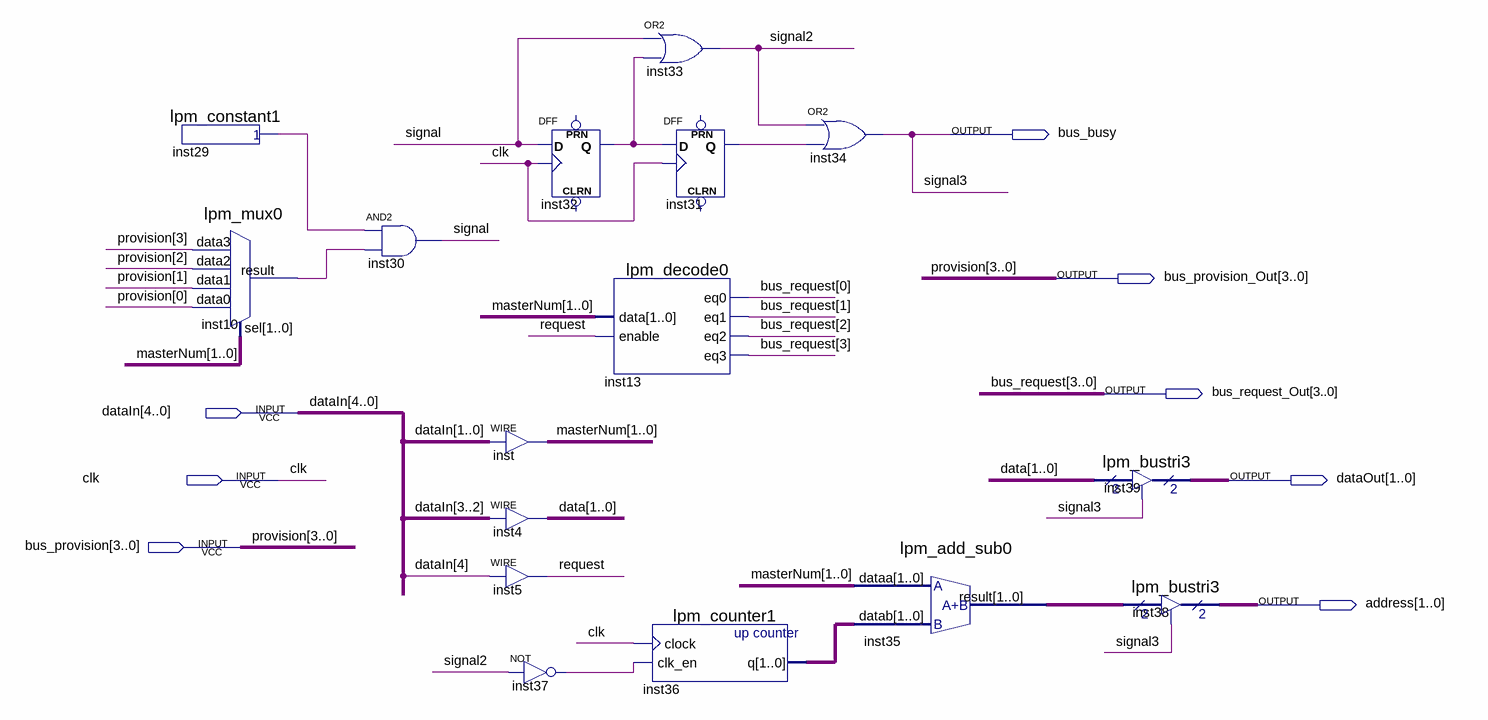
[diagram p0: schematic sheet]
// Quartus schematic Master.bdf as structural Verilog: 16 symbols, 8 pins
module Master (
  input  [4:0] dataIn,
  input  clk,
  input  [3:0] bus_provision,
  output bus_busy,
  output [3:0] bus_provision_Out,
  output [3:0] bus_request_Out,
  output [1:0] dataOut,
  output [1:0] address
);

  wire inst10_result, inst29_result, inst31_q, inst32_q, inst37_out, request, signal, signal2;
  wire [1:0] data, inst35_result, inst36_q, masterNum;

  lpm_constant1 inst29 (.result(inst29_result));
  lpm_mux0 inst10 (
    .data3(bus_provision[3]), .data2(bus_provision[2]), .data1(bus_provision[1]), .data0(bus_provision[0]),
    .sel(masterNum), .result(inst10_result));
  and inst30 (signal, inst29_result, inst10_result);
  assign masterNum = dataIn[1:0];  // WIRE inst
  assign data = dataIn[3:2];  // WIRE inst4
  assign request = dataIn[4];  // WIRE inst5
  DFF inst32 (.CLK(clk), .D(signal), .Q(inst32_q));  // open: CLRN, PRN
  not inst37 (inst37_out, signal2);
  or inst33 (signal2, signal, inst32_q);
  lpm_decode0 inst13 (
    .data(masterNum), .enable(request), .eq0(bus_request_Out[0]), .eq1(bus_request_Out[1]),
    .eq2(bus_request_Out[2]), .eq3(bus_request_Out[3]));
  lpm_counter1 inst36 (.clock(clk), .clk_en(inst37_out), .q(inst36_q));
  DFF inst31 (.CLK(clk), .D(inst32_q), .Q(inst31_q));  // open: CLRN, PRN
  or inst34 (bus_busy, signal2, inst31_q);
  lpm_add_sub0 inst35 (.dataa(masterNum), .datab(inst36_q), .result(inst35_result));
  lpm_bustri3 inst39 (.enabledt(bus_busy), .data(data), .tridata(dataOut));
  lpm_bustri3 inst38 (.enabledt(bus_busy), .data(inst35_result), .tridata(address));

  assign bus_provision_Out = bus_provision;

  // Other names for the same wires on the sheet: bus_request[3:0] = bus_request_Out; provision[3:0] = bus_provision;
  //   signal3 = bus_busy
endmodule
